# EAGLE schematic hall_sensor (EAGLE 7.3.0)
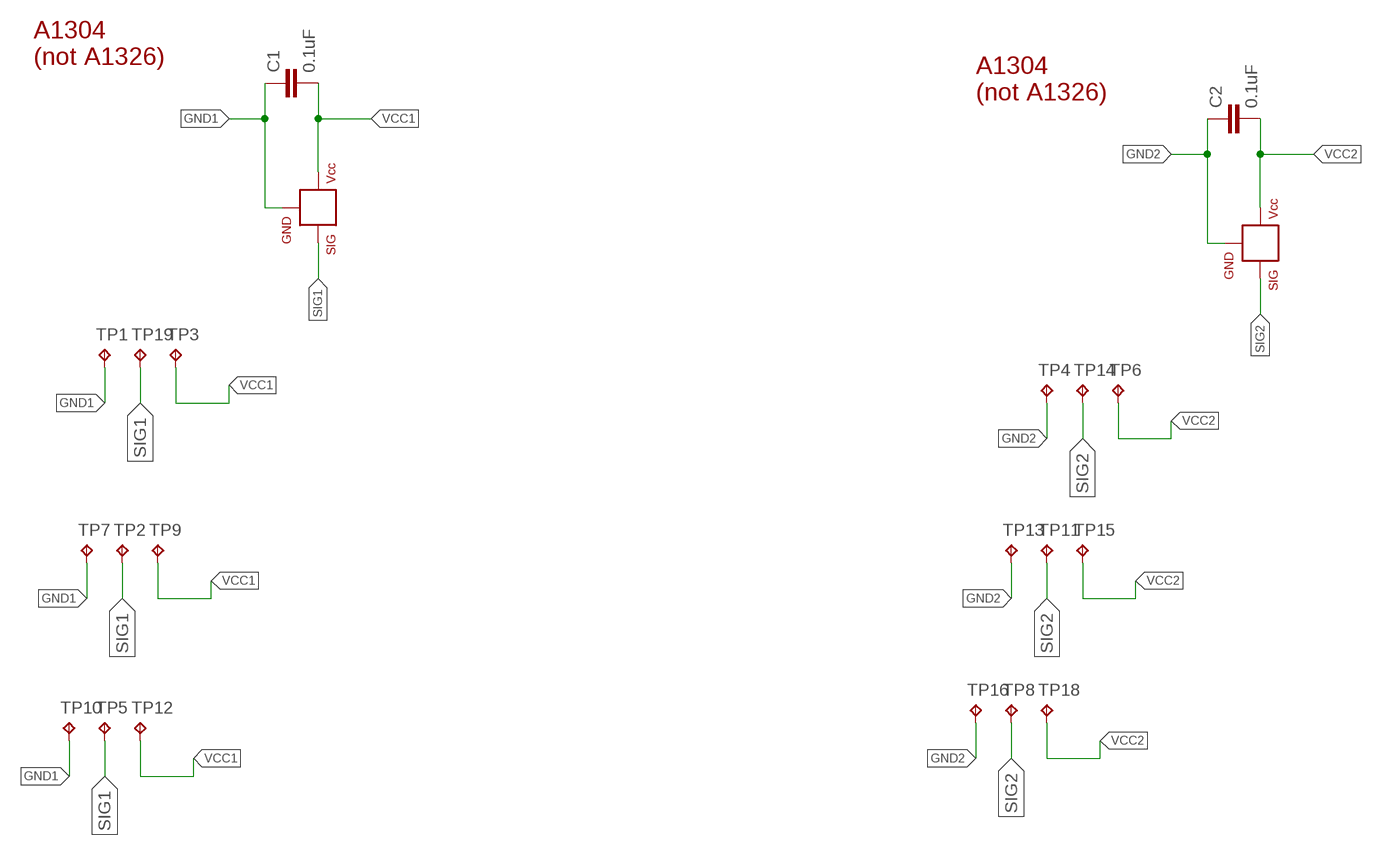
[diagram p0: schematic, sheet 1]

## Parts
C1  0.1uF  CAP0603-CAP  [0603-CAP]
C2  0.1uF  CAP0603-CAP  [0603-CAP]
HALL  HALLEFFECT-A1326  [SOT23-3]
HALL1  HALLEFFECT-A1326  [SOT23-3]
TP1  TPTP10SQ  [TP10SQ]
TP2  TPTP15R  [TP15R]
TP3  TPTP10SQ  [TP10SQ]
TP4  TPTP10SQ  [TP10SQ]
TP5  TPTP15R  [TP15R]
TP6  TPTP10SQ  [TP10SQ]
TP7  TPTP10SQ  [TP10SQ]
TP8  TPTP15R  [TP15R]
TP9  TPTP10SQ  [TP10SQ]
TP10  TPTP10SQ  [TP10SQ]
TP11  TPTP15R  [TP15R]
TP12  TPTP10SQ  [TP10SQ]
TP13  TPTP10SQ  [TP10SQ]
TP14  TPTP15R  [TP15R]
TP15  TPTP10SQ  [TP10SQ]
TP16  TPTP10SQ  [TP10SQ]
TP18  TPTP10SQ  [TP10SQ]
TP19  TPTP15R  [TP15R]

## Nets
GND1: C1.1 HALL.3(GND) TP1.TP TP7.TP TP10.TP
GND2: C2.1 HALL1.3(GND) TP4.TP TP13.TP TP16.TP
SIG1: HALL.2(SIG) TP2.TP TP5.TP TP19.TP
SIG2: HALL1.2(SIG) TP8.TP TP11.TP TP14.TP
VCC1: C1.2 HALL.1(VCC) TP3.TP TP9.TP TP12.TP
VCC2: C2.2 HALL1.1(VCC) TP6.TP TP15.TP TP18.TP

## Notes on the sheet
- A1304
  (not A1326)
- A1304
  (not A1326)

## Library data of the parts
C1 C2 = SparkFun:CAP: Capacitor Standard 0603 ceramic capacitor, and 0.1" leaded capacitor.
HALL HALL1 = Andy_Sigler:HALLEFFECT-A1326
TP1-TP16 TP18 TP19 = testpad:TP: Test pad